# EasyEDA Pro project ProDoc_cyrus_V2.epro, schematic cyrus, sheets 4 to 5 of 5

## Sheets
4 RF Subsystems: Create Date: 2026-04-18; Page Name: RF Subsystems
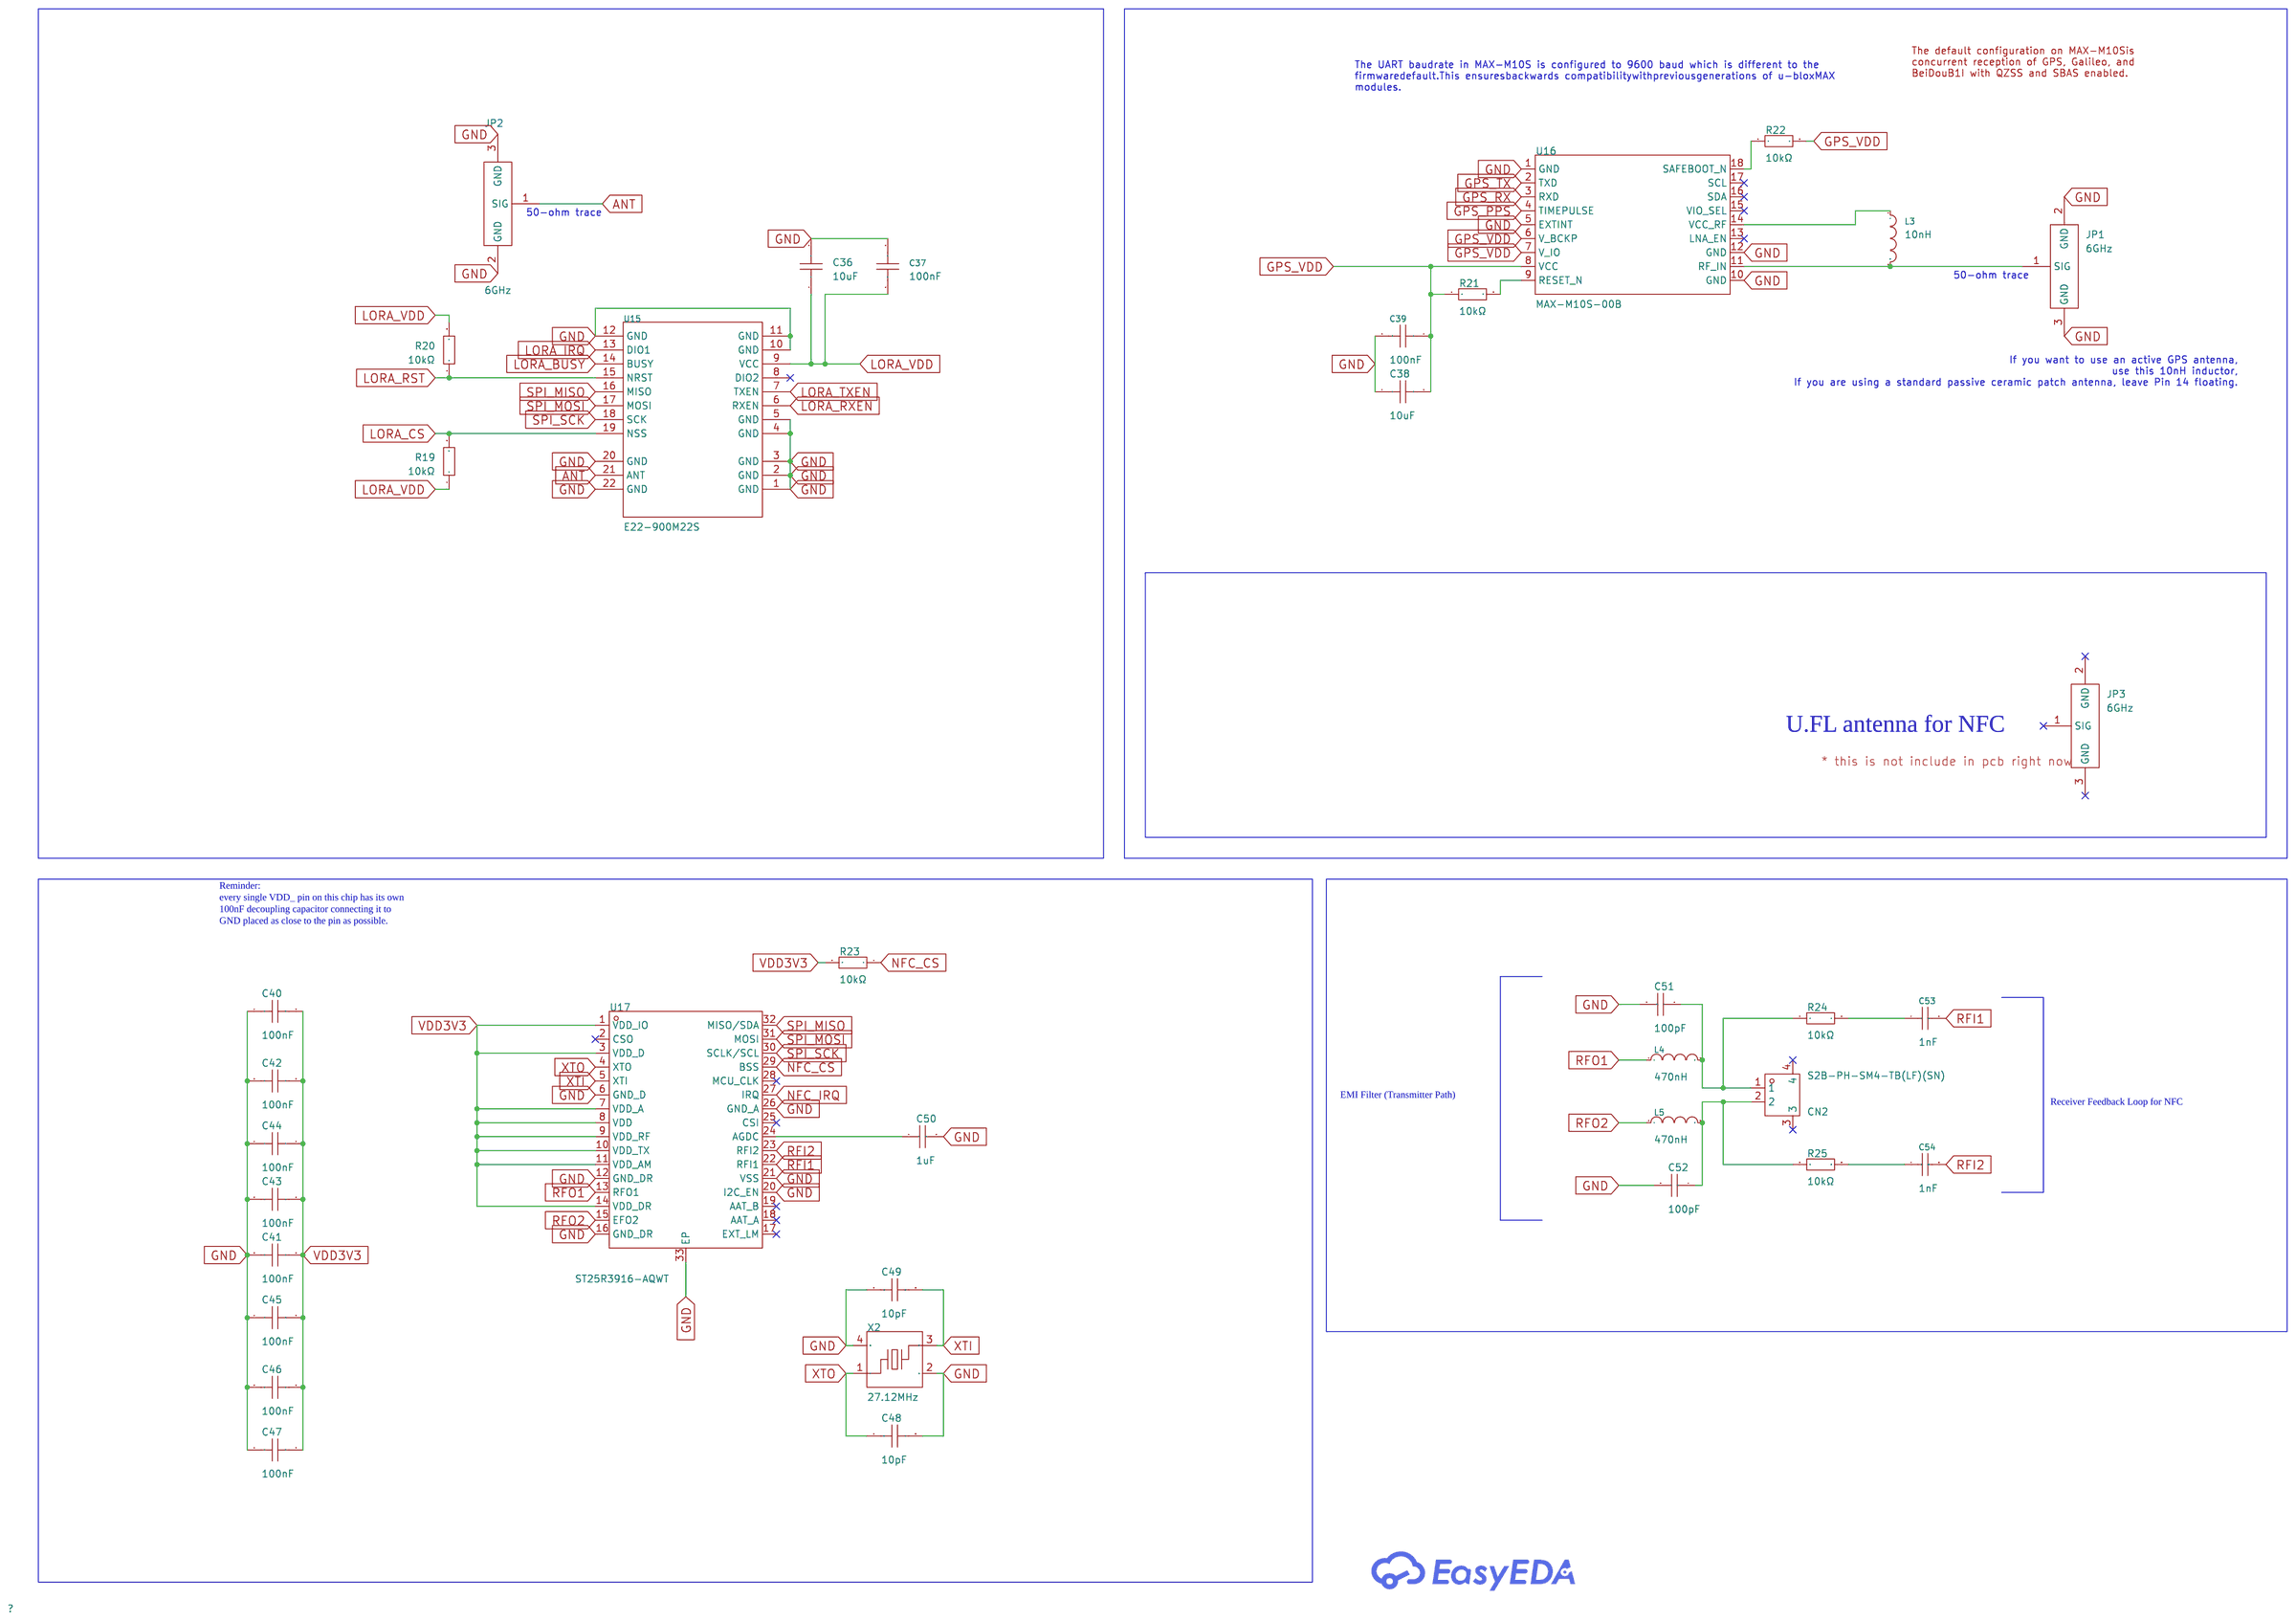
[diagram p3: RF Subsystems]
5 Audio and UI: Create Date: 2026-04-18; Page Name: Audio and UI
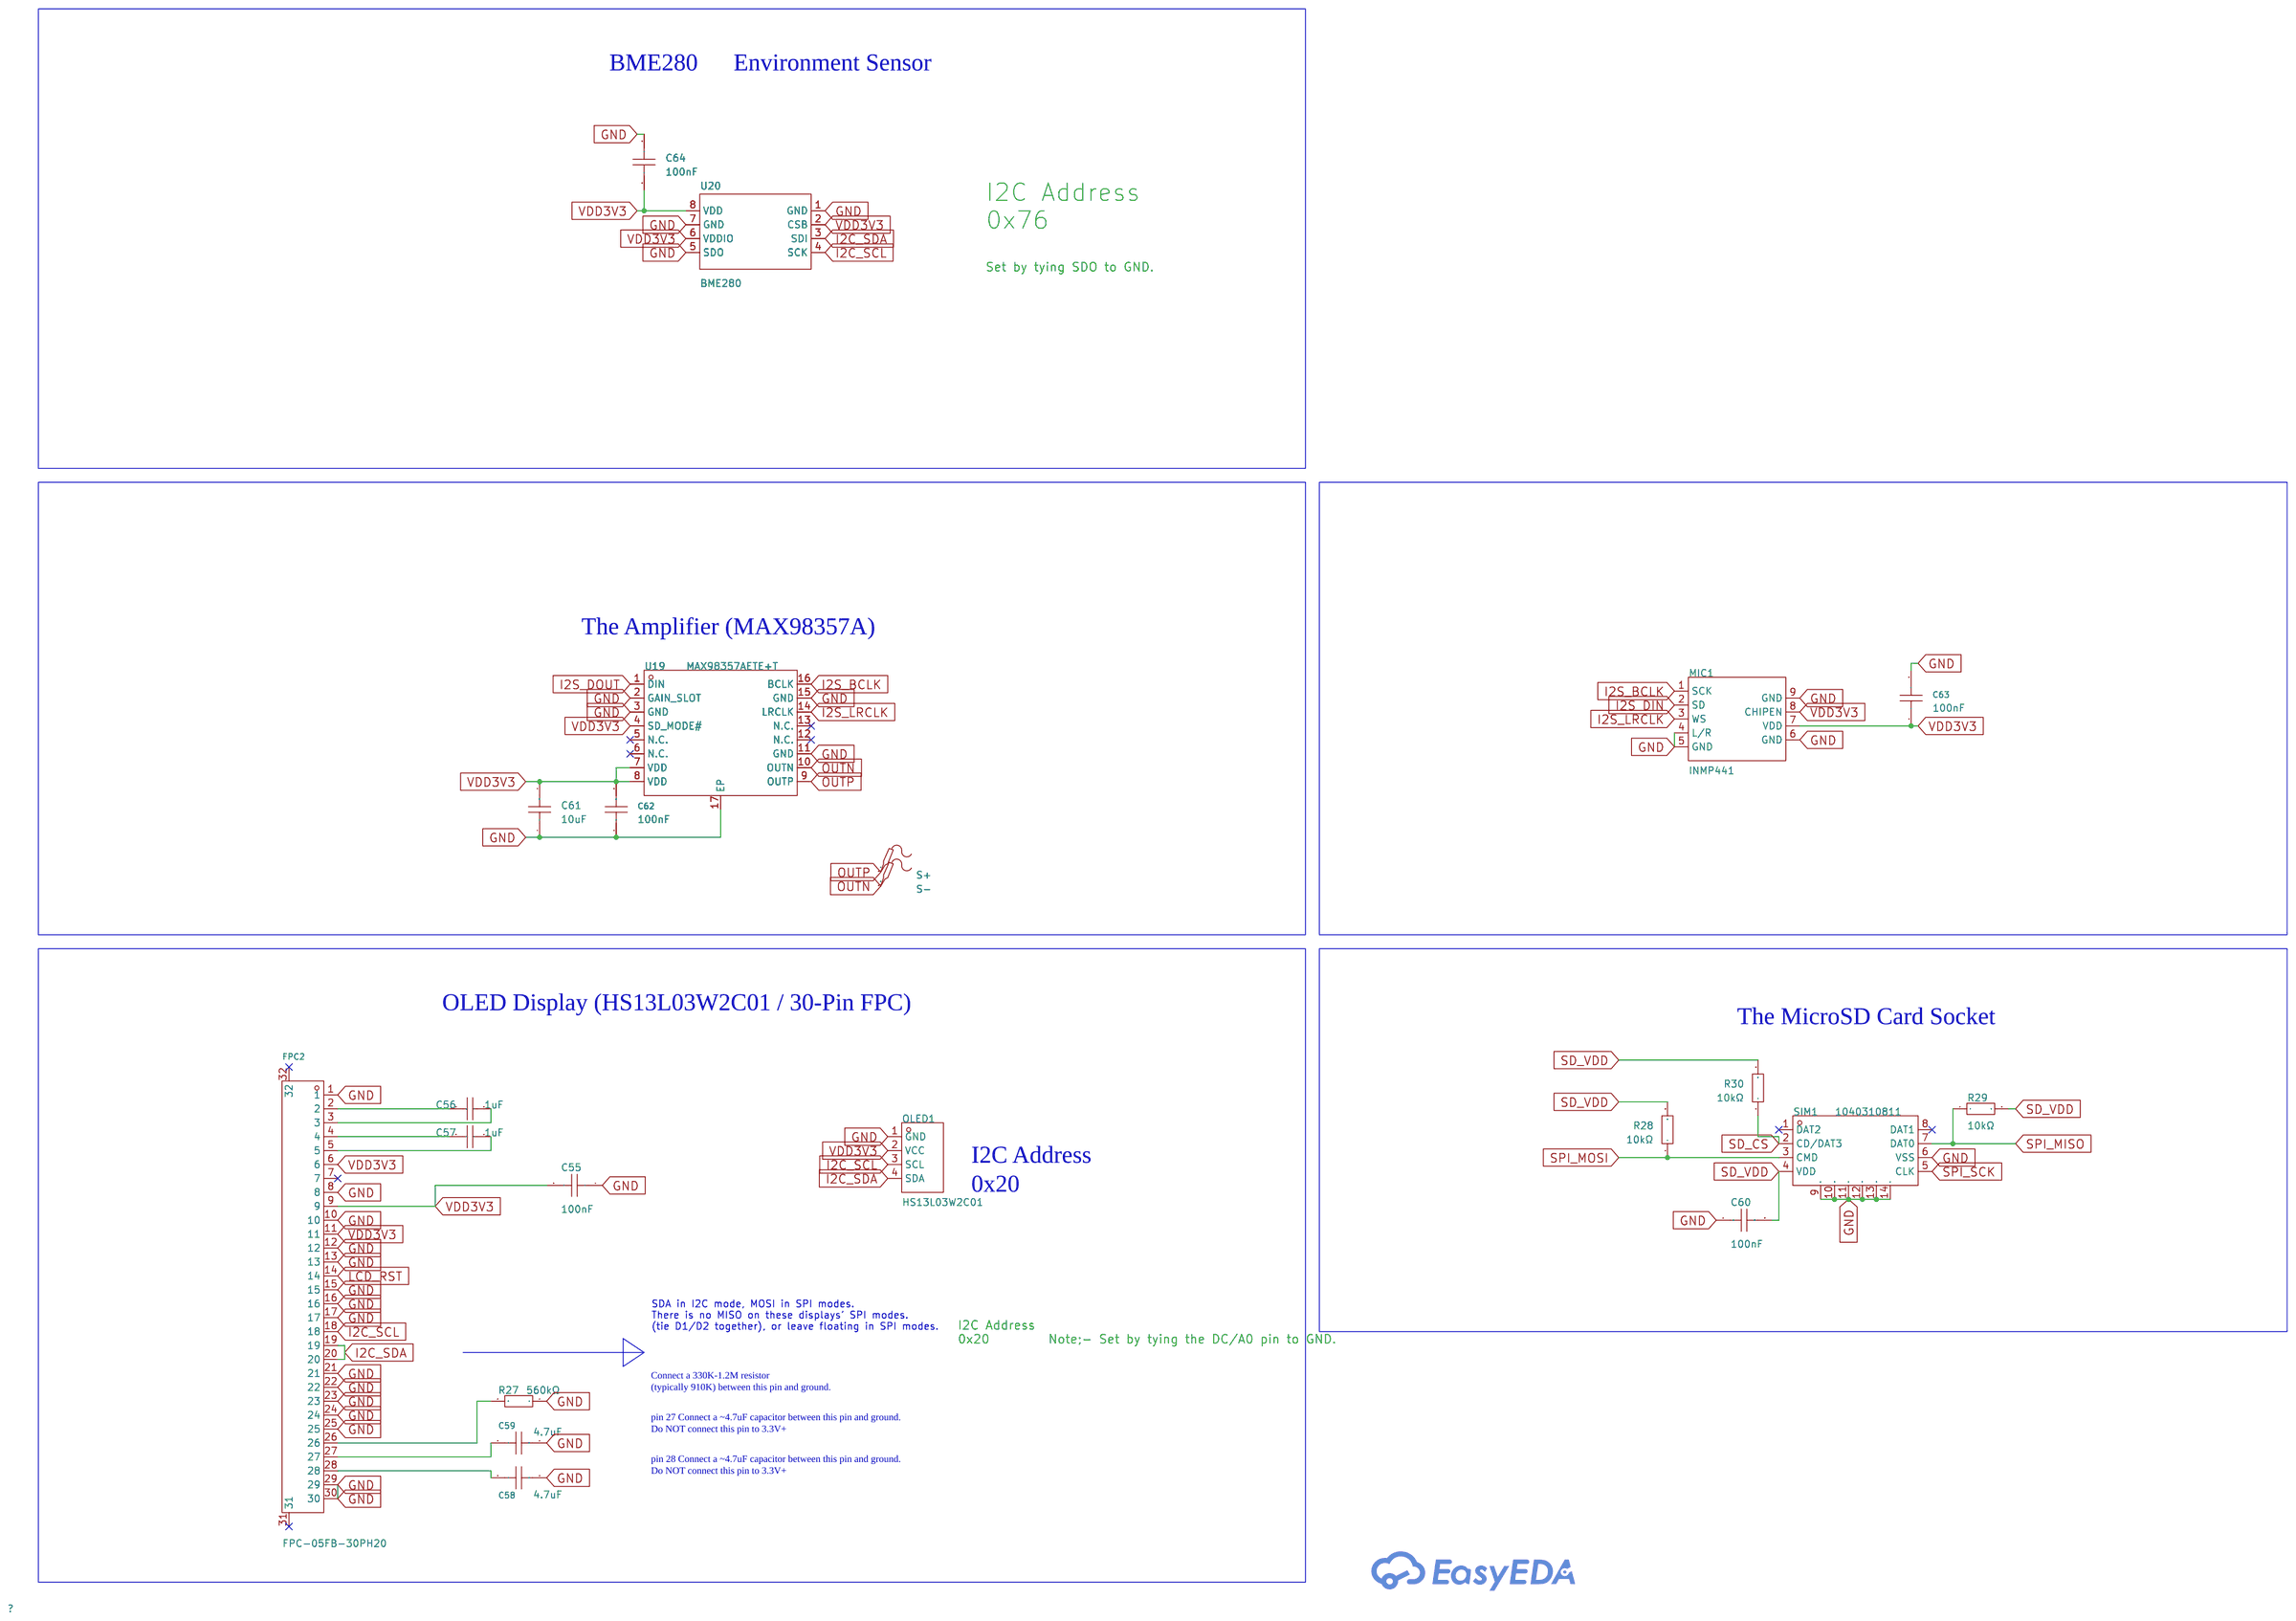
[diagram p4: Audio and UI]

## Parts
sheet Audio and UI
C55  100nF  [C0402]
C56  1uF  [C0402]
C57  1uF  [C0402]
C58  4.7uF  [C0402]
C59  4.7uF  [C0402]
C60  100nF  [C0402]
C61  10uF  [C0402]
C62  100nF  [C0402]
C63  100nF  [C0402]
C64  100nF  [C0402]
FPC2  FPC-05FB-30PH20  [FPC-SMD_30P-P0.50_FPC-05FB-30PH20]
MIC1  INMP441  [MIC-SMD_INMP441]
OLED1  HS13L03W2C01  [OLED-TH_L35.4-W33.5_HS13L03W2C01]
R27  560kΩ  [R0603]
R28  10kΩ  [R0603]
R29  10kΩ  [R0603]
R30  10kΩ  [R0603]
S+  -  [Test-Point-0.5mm]
S-  -  [Test-Point-0.5mm]
SIM1  1040310811  [SIM-SMD_8P-1040310811]
U19  MAX98357AETE+T  [TQFN-16_L3.0-W3.0-P0.50-BL-EP1.5]
U20  BME280  [LGA-8_BME280_BL]
sheet RF Subsystems
C36  10uF  [C0402]
C37  100nF  [C0402]
C38  10uF  [C0402]
C39  100nF  [C0402]
C40  100nF  [C0402]
C41  100nF  [C0402]
C42  100nF  [C0402]
C43  100nF  [C0402]
C44  100nF  [C0402]
C45  100nF  [C0402]
C46  100nF  [C0402]
C47  100nF  [C0402]
C48  10pF  [C0402]
C49  10pF  [C0402]
C50  1uF  [C0402]
C51  100pF  [C0603]
C52  100pF  [C0603]
C53  1nF  [C0603]
C54  1nF  [C0603]
CN2  S2B-PH-SM4-TB(LF)(SN)  [CONN-SMD_P2.00_S2B-PH-SM4-TB-LF-SN]
JP1  6GHz  [RF-SMD_FRF05002-JSS103M]
JP2  6GHz  [RF-SMD_FRF05002-JSS103M]
JP3  6GHz  [RF-SMD_FRF05002-JSS103M]  (no BOM)
L3  10nH  [IND-SMD_L1.6-W0.8-1]
L4  470nH  [L0603]
L5  470nH  [L0603]
R19  10kΩ  [R0603]
R20  10kΩ  [R0603]
R21  10kΩ  [R0402]
R22  10kΩ  [R0402]
R23  10kΩ  [R0603]
R24  10kΩ  [R0603]
R25  10kΩ  [R0603]
U15  E22-900M22S  [WIRELM-SMD_E22-900M22S]
U16  MAX-M10S-00B  [SMD-18_L10.1-W9.7-P1.10-TL_SKG09F]
U17  ST25R3916-AQWT  [VFQFPN-32_L5.0-W5.0-P0.50-TL-EP3.5]
X2  27.12MHz  [CRYSTAL-SMD_4P-L3.2-W2.5-BL_SIT8008BI]

## Library data of the parts
C40-C47 C55 C60 C64 = CL05B104KO5NNNC: Capacitance:100nF Tolerance:±10% Tolerance:±10% Voltage Rating:16V Temperature Coefficient:X7R; LCSC Part Name: 100nF ±10% 16V; Supplier Part: C1525; Manufacturer: SAMSUNG(三星); Supplier Footprint: 0402; JLCPCB Part Class: Basic Part; Datasheet: https://item.szlcsc.com/datasheet/CL05B104KO5NNNC/1877.html; Supplier: LCSC; Tolerance: ±10%; Voltage Rating: 16V; Temperature Coefficient: X7R
C50 C56 C57 = CL05A105KP5NNNC: Capacitance:1uF Tolerance:±10% Tolerance:±10% Voltage Rating:10V Temperature Coefficient:X5R; LCSC Part Name: 1uF ±10% 10V; Supplier Part: C14445; Manufacturer: SAMSUNG(三星); Supplier Footprint: 0402; JLCPCB Part Class: Extended Part; Datasheet: https://item.szlcsc.com/datasheet/CL05A105KP5NNNC/15107.html; Supplier: LCSC; Tolerance: ±10%; Voltage Rating: 10V; Temperature Coefficient: X5R
C58 C59 = CL05A475KP5NRNC: Capacitance:4.7uF Tolerance:±10% Tolerance:±10% Voltage Rating:10V Temperature Coefficient:X5R; LCSC Part Name: 4.7uF ±10% 10V; Supplier Part: C368809; Manufacturer: SAMSUNG(三星); Supplier Footprint: 0402; JLCPCB Part Class: Extended Part; Datasheet: https://item.szlcsc.com/datasheet/CL05A475KP5NRNC/342854.html; Supplier: LCSC; Tolerance: ±10%; Voltage Rating: 10V; Temperature Coefficient: X5R
C36 C38 C61 = CL05A106MP5NUNC_C315248: Capacitance:10uF Tolerance:±20% Tolerance:±20% Voltage Rating:10V Temperature Coefficient:X5R; LCSC Part Name: 10uF ±20% 10V; Supplier Part: C315248; Manufacturer: SAMSUNG(三星); Manufacturer Part: CL05A106MP5NUNC; Supplier Footprint: 0402; JLCPCB Part Class: Extended Part; Datasheet: https://item.szlcsc.com/datasheet/CL05A106MP5NUNC/297154.html; Supplier: LCSC; Tolerance: ±20%; Voltage Rating: 10V; Temperature Coefficient: X5R
C37 C39 C62 C63 = CC0402KRX7R7BB104: Capacitance: Tolerance:±10% Tolerance:±10% Voltage Rated: Temperature Coefficient:; LCSC Part Name: 100nF ±10% 16V; Supplier Part: C60474; Manufacturer: YAGEO(国巨); Supplier Footprint: 0402; JLCPCB Part Class: Extended Part; Datasheet: https://atta.szlcsc.com/upload/public/pdf/source/20211223/9278FD768280B81DDBEF48FA36411A03.pdf; Supplier: LCSC; Tolerance: ±10%
FPC2 = FPC-05FB-30PH20: Locking Feature:Hinged Lid Contact Type:Surface Mount Number of Contacts:30P Pitch:0.5mm Mounting Type:双侧触点/上下接 FFC, FCB Thickness:0.3mm FFC, FCB Thickness:0.3mm Height Above Board:2mm Contact Material:Phosphor Bronze Contact Plating:Tin Operating Tempera; LCSC Part Name: 翻盖式 卧贴 P数:30P 间距:0.5mm; Supplier Part: C2856833; Manufacturer: XUNPU(讯普); Supplier Footprint: SMD,P=0.5mm,卧贴; JLCPCB Part Class: Extended Part; Datasheet: https://item.szlcsc.com/datasheet/FPC-05FB-30PH20/3056931.html; Supplier: LCSC; Locking Feature: Hinged Lid; Contact Type: Surface Mount; Number of Contacts: 30P; Pitch: 0.5mm; Mounting Type: 双侧触点/上下接; FFC, FCB Thickness: 0.3mm; Height Above Board: 2mm; Contact Material: Phosphor Bronze; Contact Plating: Tin; Operating Temperature: -25℃~+85℃; Rated Voltage (Max): 50V; Current Rating (Max): 500mA
MIC1 = INMP441: Supplier Part: C5438445; Manufacturer: TDK InvenSense(应美盛); Supplier Footprint: SMD-9; JLCPCB Part Class: Extended Part; Datasheet: https://item.szlcsc.com/datasheet/INMP441/6315022.html; Supplier: LCSC
OLED1 = HS13L03W2C01: Main Control Chip:SH1106 Interface Type:I2C Size:1.3 Operating Temperature:-40℃~+70℃ Operating Temperature:-40℃~+70℃; LCSC Part Name: 1.3'1.3寸 128*64 OLED显示屏 I2C通讯 SH1106 白光; Supplier Part: C7465997; Manufacturer: HS(汉昇); JLCPCB Part Class: Extended Part; Datasheet: https://atta.szlcsc.com/upload/public/pdf/source/20230720/8731A47396DED074CDCD72E9ACEFB46F.pdf; Supplier: LCSC; Main Control Chip: SH1106; Interface Type: I2C; Size: 1.3; Operating Temperature: -40℃~+70℃
R27 = RC0603FR-07560KL: Type:Thick Film Resistors Resistance: Tolerance:±1% Tolerance:±1% Power(Watts): Overload Voltage (Max): Temperature Coefficient:±100ppm/℃ Temperature Coefficient:±100ppm/℃ Operating Temperature Range:-55℃~+155℃ Operating Temperature Range:-55℃~+155℃; LCSC Part Name: 厚膜电阻 560kΩ ±1% 100mW; Supplier Part: C137699; Manufacturer: YAGEO(国巨); Supplier Footprint: 0603; JLCPCB Part Class: Extended Part; Datasheet: https://atta.szlcsc.com/upload/public/pdf/source/20180821/C275644_0D56F95EFF785E7D9A1FEF436B37DA78.pdf; Supplier: LCSC; Type: Thick Film Resistors; Tolerance: ±1%; Temperature Coefficient: ±100ppm/℃; Operating Temperature Range: -55℃~+155℃
R19 R20 R23-R25 R28-R30 = RC0603FR-0710KL: Type:Thick Film Resistors Resistance: Tolerance:±1% Tolerance:±1% Power(Watts): Overload Voltage (Max): Temperature Coefficient:±100ppm/℃ Temperature Coefficient:±100ppm/℃ Operating Temperature Range:-55℃~+155℃ Operating Temperature Range:-55℃~+155℃; LCSC Part Name: 厚膜电阻 10kΩ ±1% 100mW; Supplier Part: C98220; Manufacturer: YAGEO(国巨); Supplier Footprint: 0603; JLCPCB Part Class: Extended Part; Datasheet: https://atta.szlcsc.com/upload/public/pdf/source/20180927/C295883_E8D83085EA81BD7DE0B2B681138C15EE.pdf; Supplier: LCSC; Type: Thick Film Resistors; Tolerance: ±1%; Temperature Coefficient: ±100ppm/℃; Operating Temperature Range: -55℃~+155℃
S+ S- = Test-Point: Test Point 测试点
SIM1 = 1040310811: Card Connection Mode:Push-Pull Card Type:MicroSD Card (TF Card) Connector Type:Connector and Ejector Additional Card Detection Pins:- Supplementary Features:- Height Above Board:1.42mm Operating Temperature:-25℃~+85℃ Operating Temperature:-25℃~+85℃; LCSC Part Name: 拔插式 MicroSD卡(TF卡) 卡座; Supplier Part: C585350; Manufacturer: MOLEX; Supplier Footprint: SMD; JLCPCB Part Class: Extended Part; Datasheet: https://www.molex.com/content/dam/molex/molex-dot-com/products/automated/en-us/salesdrawingpdf/104/104031/1040310811_sd.pdf?inline; Supplier: LCSC; Card Connection Mode: Push-Pull; Card Type: MicroSD Card (TF Card); Connector Type: Connector and Ejector; Height Above Board: 1.42mm; Operating Temperature: -25℃~+85℃
U19 = MAX98357AETE+T: Class:Class D Speaker Channels:- Output Power:3.2W×1@4Ω Voltage - Supply:2.5V~5.5V Voltage - Supply:2.5V~5.5V Total Harmonic Distortion + Noise (THD+N):- Quiescent Current:2.4mA Operating Temperature:-40℃~+85℃ Operating Temperature:-40℃~+85℃ Power Supply; LCSC Part Name: 微型、低成本、PCM 类 D 级放大器具有 AB 级性能; Supplier Part: C910544; Manufacturer: ADI(亚德诺)/MAXIM(美信); Supplier Footprint: TQFN-16-EP(3x3); JLCPCB Part Class: Extended Part; Datasheet: https://item.szlcsc.com/datasheet/MAX98357AETE%252BT/978950.html; Supplier: LCSC; Class: Class D; Output Power: 3.2W×1@4Ω; Voltage - Supply: 2.5V~5.5V; Quiescent Current: 2.4mA; Operating Temperature: -40℃~+85℃; Power Supply Rejection Ratio (PSRR): 77dB; Efficiency: 92%
U20 = BME280: Temperature Range:-40℃~+85℃ Temperature Range:-40℃~+85℃ Humidity:0%RH~100%RH Humidity:0%RH~100%RH Interface:I2C；SPI Voltage - Supply:1.71V~3.6V Voltage - Supply:1.71V~3.6V Current - Supply:1.8uA Humidity Tolerance:±3%RH Humidity Tolerance:±3%RH Temperatur; LCSC Part Name: 湿度：0%RH~100%RH; Supplier Part: C92489; Manufacturer: Bosch(博世); Supplier Footprint: LGA-8(2.5x2.5); JLCPCB Part Class: Extended Part; Datasheet: https://item.szlcsc.com/datasheet/BME280/93682.html; Supplier: LCSC; Temperature Range: -40℃~+85℃; Humidity: 0%RH~100%RH; Interface: I2C；SPI; Voltage - Supply: 1.71V~3.6V; Current - Supply: 1.8uA; Humidity Tolerance: ±3%RH; Temperature Tolerance: ±0.5℃; Resolution: 16bit
C48 C49 = CL05C100JB5NNNC: Capacitance:10pF Tolerance:±5% Tolerance:±5% Voltage Rating:50V Temperature Coefficient:C0G; LCSC Part Name: 10pF ±5% 50V; Supplier Part: C32949; Manufacturer: SAMSUNG(三星); Supplier Footprint: 0402; JLCPCB Part Class: Basic Part; Datasheet: https://item.szlcsc.com/datasheet/CL05C100JB5NNNC/33914.html; Supplier: LCSC; Tolerance: ±5%; Voltage Rating: 50V; Temperature Coefficient: C0G
C51 C52 = CL10C101JB8NNNC: Capacitance:100pF Tolerance:±5% Tolerance:±5% Voltage Rating:50V Temperature Coefficient:C0G; LCSC Part Name: 100pF ±5% 50V; Supplier Part: C14858; Manufacturer: SAMSUNG(三星); Supplier Footprint: 0603; JLCPCB Part Class: Basic Part; Datasheet: https://item.szlcsc.com/datasheet/CL10C101JB8NNNC/15530.html; Supplier: LCSC; Tolerance: ±5%; Voltage Rating: 50V; Temperature Coefficient: C0G
C53 C54 = CL10B102KB8NNNC: Capacitance:1nF Tolerance:±10% Tolerance:±10% Voltage Rating:50V Temperature Coefficient:X7R; LCSC Part Name: 1nF ±10% 50V; Supplier Part: C1588; Manufacturer: SAMSUNG(三星); Supplier Footprint: 0603; JLCPCB Part Class: Basic Part; Datasheet: https://item.szlcsc.com/datasheet/CL10B102KB8NNNC/1940.html; Supplier: LCSC; Tolerance: ±10%; Voltage Rating: 50V; Temperature Coefficient: X7R
CN2 = S2B-PH-SM4-TB(LF)(SN): Pins Structure:1x2P Pitch:2mm Mounting Style:Horizontal attachment Reference Series:PH Number of Pins:2P Number of Rows:1 Number of PINs Per Row:2 Row Spacing:- Current Rating (Max):2A Contact Material:Copper alloy Contact Plating:Tin Operating Temperatur; LCSC Part Name: 1x2P 间距:2mm 卧贴 系列:PH; Supplier Part: C295747; Manufacturer: JST; Supplier Footprint: SMD,P=2mm,卧贴; JLCPCB Part Class: Extended Part; Datasheet: https://atta.szlcsc.com/upload/public/pdf/source/20210203/C295747_344B2E64535E381E727D98C302AB61C7.pdf; Supplier: LCSC; Pins Structure: 1x2P; Pitch: 2mm; Mounting Style: Horizontal attachment; Reference Series: PH; Number of Pins: 2P; Number of Rows: 1; Number of PINs Per Row: 2; Current Rating (Max): 2A; Contact Material: Copper alloy; Contact Plating: Tin; Operating Temperature Range: -25℃~+85℃; Rated Voltage (Max): 100V; Plastic Material: PA; Flame Retardant Rating: UL94V-0; Supplementary Features: Auxiliary soldering legs; Colour: Beige; Z-Height of the Board: 5.5mm; X-Length of Bottom Edge on Board (Spacing Line): 7.9mm; Y-Width of Bottom Edge on Board: 8.6mm
JP1-JP3 = U.FL-R-SMT-1(80)_C88374: Connector Type:Board Side Interface:Male Pin Number of Ports:1 Interface Diameter:2mm Interface Length/Height:1.25mm Frequency:6GHz RF Series:IPEX Impedance:50Ω Style:- Operating Temperature Range:-40℃~+90℃ Operating Temperature Range:-40℃~+90℃; LCSC Part Name: IPEX 内针; Supplier Part: C88374; Manufacturer: HRS(广濑); Manufacturer Part: U.FL-R-SMT-1(80); Supplier Footprint: SMD; JLCPCB Part Class: Extended Part; Datasheet: https://item.szlcsc.com/datasheet/U.FL-R-SMT-1(80)/89553.html; Supplier: LCSC; Connector Type: Board Side; Interface: Male Pin; Number of Ports: 1; Interface Diameter: 2mm; Interface Length/Height: 1.25mm; RF Series: IPEX; Impedance: 50Ω; Operating Temperature Range: -40℃~+90℃
L3 = LQW18AN10NG00D: Inductance: Tolerance:±2% Tolerance:±2% Rated Current: Saturation Current (Isat):- DC Resistance (DCR): Ratings:-; LCSC Part Name: 10nH ±2%; Supplier Part: C86131; Manufacturer: muRata(村田); Supplier Footprint: 0603; JLCPCB Part Class: Extended Part; Datasheet: https://atta.szlcsc.com/upload/public/pdf/source/20180326/C86131_3B1D5A72F483F9A0E724D5F6F39FB88F.pdf; Supplier: LCSC; Tolerance: ±2%
L4 L5 = LQW18ANR47G00D: Inductance:470nH Tolerance:±2% Tolerance:±2% Current Rating:75mA Current - Saturation(Isat):- DC Resistance(DCR):7Ω Type:Unshielded Inductor Ratings:-; LCSC Part Name: 470nH ±2%; Supplier Part: C113132; Manufacturer: muRata(村田); Supplier Footprint: 0603; JLCPCB Part Class: Extended Part; Datasheet: https://item.szlcsc.com/datasheet/LQW18ANR47G00D/114367.html; Supplier: LCSC; Tolerance: ±2%; Current Rating: 75mA; DC Resistance(DCR): 7Ω; Type: Unshielded Inductor
R21 R22 = RC0402FR-0710KL: Type:Thick Film Resistor Resistance:10kΩ Tolerance:±1% Tolerance:±1% Power(Watts):62.5mW Voltage-Supply(Max):50V Temperature Coefficient:±100ppm/℃ Temperature Coefficient:±100ppm/℃ Operating Temperature:-55℃~+155℃ Operating Temperature:-55℃~+155℃; LCSC Part Name: 厚膜电阻 10kΩ ±1% 62.5mW; Supplier Part: C60490; Manufacturer: YAGEO(国巨); Supplier Footprint: 0402; JLCPCB Part Class: Extended Part; Datasheet: https://item.szlcsc.com/datasheet/RC0402FR-0710KL/61542.html; Supplier: LCSC; Type: Thick Film Resistor; Tolerance: ±1%; Power(Watts): 62.5mW; Voltage-Supply(Max): 50V; Temperature Coefficient: ±100ppm/℃; Operating Temperature: -55℃~+155℃
U15 = E22-900M22S: Output Power:22.3dBm Output Power:22.3dBm Interface Type:SPI Modulation System:LoRa；FSK Voltage - Supply:2.5V~3.7V Voltage - Supply:2.5V~3.7V Antenna Type:Stamp Hole Antenna；IPEX interface Receive  Current:6.8mA Send  Current:119mA Sensitivity:-147dBm Sen; LCSC Part Name: 868/915MHz贴片型LoRa模块; Supplier Part: C411293; Manufacturer: EBYTE(亿佰特); Supplier Footprint: SMD,20x14mm; JLCPCB Part Class: Extended Part; Datasheet: https://item.szlcsc.com/datasheet/E22-900M22S/402604.html; Supplier: LCSC; Output Power: 22.3dBm; Interface Type: SPI; Modulation System: LoRa；FSK; Voltage - Supply: 2.5V~3.7V; Antenna Type: Stamp Hole Antenna；IPEX interface; Receive  Current: 6.8mA; Send  Current: 119mA; Sensitivity: -147dBm; Communication Distance: 7km
U16 = MAX-M10S-00B: Supplier Part: C4153167; Manufacturer: U-BLOX(优北罗); Supplier Footprint: LCC-18(9.7x10.1); JLCPCB Part Class: Extended Part; Datasheet: https://item.szlcsc.com/datasheet/MAX-M10S-00B/4722633.html; Supplier: LCSC
U17 = ST25R3916-AQWT_C2908147: agreement:FeliCa；ISO 15693；MIFARE；ISO 14443；NFC Interface:I2C；SPI Voltage - Supply:2.4V~5.5V Voltage - Supply:2.4V~5.5V; Supplier Part: C2908147; Manufacturer: ST(意法半导体); Supplier Footprint: VFQFN-32(5x5); JLCPCB Part Class: Extended Part; Datasheet: https://item.szlcsc.com/datasheet/ST25R3916-AQWT/3181945.html; Supplier: LCSC; agreement: FeliCa；ISO 15693；MIFARE；ISO 14443；NFC; Interface: I2C；SPI; Voltage - Supply: 2.4V~5.5V
X2 = XL2EL89CSI-111YLC-27.12M: Type:Crystal Oscillator Frequency:27.12MHz Normal temperature Frequency Tolerance:±10ppm Normal temperature Frequency Tolerance:±10ppm Load Capacitance:20pF Frequency Stability:±20ppm Frequency Stability:±20ppm Operating Temperature:-40℃~+85℃ Operating Te; LCSC Part Name: YSX321SL 27.12MHZ 4P 3225 20PF ±10PPM -40~85℃ (±20PPM); Supplier Part: C5444554; Manufacturer: YXC(扬兴晶振); Supplier Footprint: SMD3225-4P; JLCPCB Part Class: Extended Part; Datasheet: https://item.szlcsc.com/datasheet/XL2EL89CSI-111YLC-27.12M/6336550.html; Supplier: LCSC; Type: Crystal Oscillator; Normal temperature Frequency Tolerance: ±10ppm; Load Capacitance: 20pF; Frequency Stability: ±20ppm; Operating Temperature: -40℃~+85℃

## Nets
GND: C36.2 C37.2 C38.1 C39.2 C40.1 C41.1 C42.1 C43.1 C44.1 C45.1 C46.1 C47.1 C48.2 C49.1 C50.2 C51.2 C52.2 C55.1 C58.1 C59.1 C60.1 C61.1 C62.1 C63.2 C64.2 FPC2.1 FPC2.8 FPC2.10 FPC2.12 FPC2.13 FPC2.15 FPC2.16 FPC2.17 FPC2.21 FPC2.22 FPC2.23 FPC2.24 FPC2.25 FPC2.29 FPC2.30 JP1.2(GND) JP1.3(GND) JP2.2(GND) JP2.3(GND) MIC1.4(L/R) MIC1.5(GND) MIC1.6(GND) MIC1.9(GND) OLED1.1(GND) R27.1 SIM1.6(VSS) SIM1.9 SIM1.10 SIM1.11 SIM1.12 SIM1.13 SIM1.14 U15.1(GND) U15.2(GND) U15.3(GND) U15.4(GND) U15.5(GND) U15.10(GND) U15.11(GND) U15.12(GND) U15.20(GND) U15.22(GND) U16.1(GND) U16.5(EXTINT) U16.10(GND) U16.12(GND) U17.6(GND_D) U17.12(GND_DR) U17.16(GND_DR) U17.20(I2C_EN) U17.21(VSS) U17.26(GND_A) U17.33(EP) U19.2(GAIN_SLOT) U19.3(GND) U19.11(GND) U19.15(GND) U19.17(EP) U20.1(GND) U20.5(SDO) U20.7(GND) X2.2(GND) X2.4(GND) ; also on sheet 1 2 3
VDD3V3: C40.2 C41.2 C42.2 C43.2 C44.2 C45.2 C46.2 C47.2 C55.2 C61.2 C62.2 C63.1 C64.1 FPC2.6 FPC2.9 FPC2.11 MIC1.7(VDD) MIC1.8(CHIPEN) OLED1.2(VCC) R23.2 U17.1(VDD_IO) U17.3(VDD_D) U17.7(VDD_A) U17.8(VDD) U17.9(VDD_RF) U17.10(VDD_TX) U17.11(VDD_AM) U17.14(VDD_DR) U19.4(SD_MODE#) U19.7(VDD) U19.8(VDD) U20.2(CSB) U20.6(VDDIO) U20.8(VDD) ; also on sheet 1 2 3
ANT: JP2.1(SIG) U15.21(ANT)
GPS_PPS: U16.4(TIMEPULSE) ; also on sheet 2
GPS_RX: U16.3(RXD) ; also on sheet 2
GPS_TX: U16.2(TXD) ; also on sheet 2
GPS_VDD: C38.2 C39.1 R21.1 R22.2 U16.6(V_BCKP) U16.7(V_IO) U16.8(VCC) ; also on sheet 1
I2C_SCL: FPC2.18 OLED1.3(SCL) U20.4(SCK) ; also on sheet 1 2 3
I2C_SDA: FPC2.19 FPC2.20 OLED1.4(SDA) U20.3(SDI) ; also on sheet 1 2 3
I2S_BCLK: MIC1.1(SCK) U19.16(BCLK) ; also on sheet 2
I2S_DIN: MIC1.2(SD) ; also on sheet 2
I2S_DOUT: U19.1(DIN) ; also on sheet 2
I2S_LRCLK: MIC1.3(WS) U19.14(LRCLK) ; also on sheet 2
LCD_RST: FPC2.14 ; also on sheet 3
LORA_BUSY: U15.14(BUSY) ; also on sheet 2
LORA_CS: R19.2 U15.19(NSS) ; also on sheet 2
LORA_IRQ: U15.13(DIO1) ; also on sheet 2
LORA_RST: R20.1 U15.15(NRST) ; also on sheet 2
LORA_RXEN: U15.6(RXEN) ; also on sheet 2
LORA_TXEN: U15.7(TXEN) ; also on sheet 2
LORA_VDD: C36.1 C37.1 R19.1 R20.2 U15.9(VCC) ; also on sheet 1
NFC_CS: R23.1 U17.29(BSS) ; also on sheet 2
NFC_IRQ: U17.27(IRQ) ; also on sheet 2
OUTN: S-.1 U19.10(OUTN)
OUTP: S+.1 U19.9(OUTP)
RFI1: C53.2 U17.22(RFI1)
RFI2: C54.2 U17.23(RFI2)
RFO1: L4.1 U17.13(RFO1)
RFO2: L5.1 U17.15(EFO2)
SD_CS: R30.1 SIM1.2(CD/DAT3) ; also on sheet 2
SD_VDD: C60.2 R28.2 R29.2 R30.2 SIM1.4(VDD) ; also on sheet 1
SPI_MISO: R29.1 SIM1.7(DAT0) U15.16(MISO) U17.32(MISO/SDA) ; also on sheet 2
SPI_MOSI: R28.1 SIM1.3(CMD) U15.17(MOSI) U17.31(MOSI) ; also on sheet 2
SPI_SCK: SIM1.5(CLK) U15.18(SCK) U17.30(SCLK/SCL) ; also on sheet 2
XTI: C49.2 U17.5(XTI) X2.3
XTO: C48.1 U17.4(XTO) X2.1
$4N2100: R21.2 U16.9(RESET_N)
$4N2157: R22.1 U16.18(SAFEBOOT_N)
$4N3909: C50.1 U17.24(AGDC)
$4N4601: C53.1 R24.2
$4N4826: C54.1 R25.2
$5N1225: C56.2 FPC2.2
$5N1231: C56.1 FPC2.3
$5N1292: C57.1 FPC2.5
$5N1298: C57.2 FPC2.4
$5N1370: C58.2 FPC2.28
$5N1440: C59.2 FPC2.27
$5N1536: FPC2.26 R27.2
Net-(C51-1): C51.1 CN2.1 L4.2 R24.1
Net-(C52-1): C52.1 CN2.2 L5.2 R25.1
Net-(JP1-1): JP1.1(SIG) L3.2 U16.11(RF_IN)
Net-(L3-1): L3.1 U16.14(VCC_RF)

Not connected (* = marked no-connect by the designer): CN2 3* 4*; FPC2 7* 31* 32*; JP3 1(SIG)* 2(GND)* 3(GND)*; SIM1 1(DAT2)* 8(DAT1)*; U15 8(DIO2)*; U16 13(LNA_EN)* 15(VIO_SEL)* 16(SDA)* 17(SCL)*; U17 2(CSO)* 17(EXT_LM)* 18(AAT_A)* 19(AAT_B)* 25(CSI)* 28(MCU_CLK)*; U19 5(N.C.)* 6(N.C.)* 12(N.C.)* 13(N.C.)*

## Notes on the sheets
sheet 4
- The default configuration on MAX-M10Sis
  concurrent reception of GPS, Galileo, and
  BeiDouB1I with QZSS and SBAS enabled.
- The UART baudrate in MAX-M10S is configured to 9600 baud which is different to the
  firmwaredefault.This ensuresbackwards compatibilitywithpreviousgenerations of u-bloxMAX
  modules.
- 50-ohm trace
- 50-ohm trace
- If you want to use an active GPS antenna,
  use this 10nH inductor,
  If you are using a standard passive ceramic patch antenna, leave Pin 14 floating.
- U.FL antenna for NFC
- * this is not include in pcb right now
- Reminder:
  every single VDD_ pin on this chip has its own
  100nF decoupling capacitor connecting it to
  GND placed as close to the pin as possible.
- EMI Filter (Transmitter Path)
- Receiver Feedback Loop for NFC
sheet 5
- BME280	Environment Sensor
- I2C Address
  0x76
- Set by tying SDO to GND.
- The Amplifier (MAX98357A)
- OLED Display (HS13L03W2C01 / 30-Pin FPC)
- The MicroSD Card Socket
- I2C Address
  0x20
- SDA in I2C mode, MOSI in SPI modes.
  There is no MISO on these displays’ SPI modes.
  (tie D1/D2 together), or leave floating in SPI modes.
- I2C Address
  0x20
- Note;- Set by tying the DC/A0 pin to GND.
- Connect a 330K-1.2M resistor
  (typically 910K) between this pin and ground.
- pin 27 Connect a ~4.7uF capacitor between this pin and ground.
  Do NOT connect this pin to 3.3V+
- pin 28 Connect a ~4.7uF capacitor between this pin and ground.
  Do NOT connect this pin to 3.3V+
